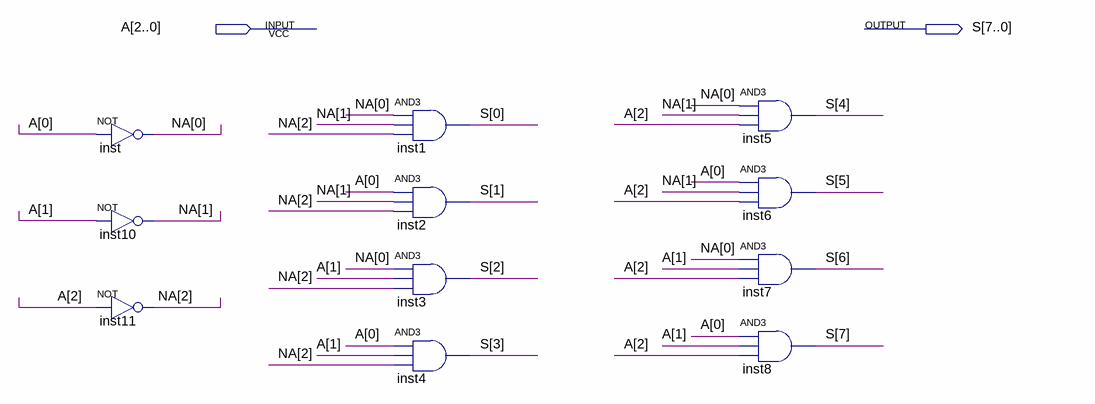
[diagram p0: schematic sheet]
// Quartus schematic Decoder.bdf as structural Verilog: 11 symbols, 2 pins
module Decoder (
  input  [2:0] A,
  output [7:0] S
);

  wire [2:0] NA;

  not inst (NA[0], A[0]);
  not inst10 (NA[1], A[1]);
  not inst11 (NA[2], A[2]);
  and inst1 (S[0], NA[0], NA[1], NA[2]);
  and inst2 (S[1], A[0], NA[1], NA[2]);
  and inst3 (S[2], NA[0], A[1], NA[2]);
  and inst4 (S[3], A[0], A[1], NA[2]);
  and inst5 (S[4], NA[0], NA[1], A[2]);
  and inst6 (S[5], A[0], NA[1], A[2]);
  and inst7 (S[6], NA[0], A[1], A[2]);
  and inst8 (S[7], A[0], A[1], A[2]);
endmodule
